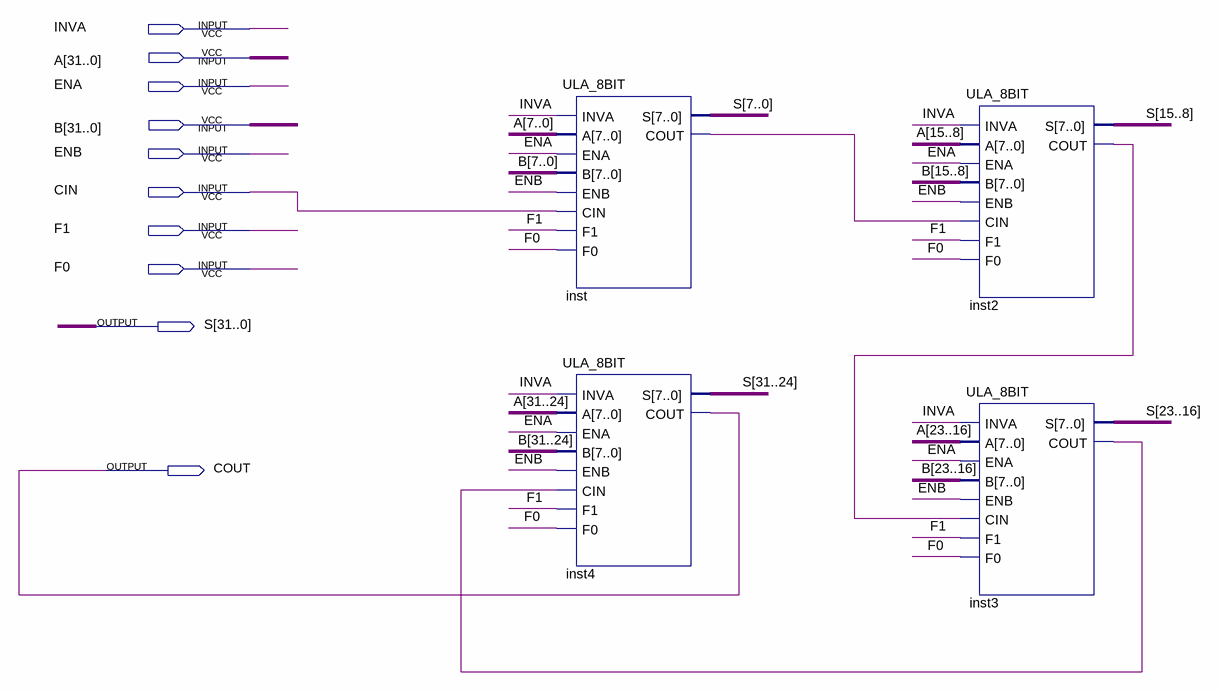
[diagram p0: schematic sheet]
// Quartus schematic ULA_32BIT.bdf as structural Verilog: 4 symbols, 10 pins
module ULA_32BIT (
  input  INVA,
  input  [31:0] A,
  input  ENA,
  input  [31:0] B,
  input  ENB,
  input  CIN,
  input  F1,
  input  F0,
  output [31:0] S,
  output COUT
);

  wire inst2_cout, inst3_cout, inst_cout;

  ULA_8BIT inst (
    .INVA(INVA), .A(A[7:0]), .ENA(ENA), .B(B[7:0]), .ENB(ENB), .CIN(CIN), .F1(F1), .F0(F0), .S(S[7:0]),
    .COUT(inst_cout));
  ULA_8BIT inst4 (
    .INVA(INVA), .A(A[31:24]), .ENA(ENA), .B(B[31:24]), .ENB(ENB), .CIN(inst3_cout), .F1(F1), .F0(F0),
    .S(S[31:24]), .COUT(COUT));
  ULA_8BIT inst2 (
    .INVA(INVA), .A(A[15:8]), .ENA(ENA), .B(B[15:8]), .ENB(ENB), .CIN(inst_cout), .F1(F1), .F0(F0),
    .S(S[15:8]), .COUT(inst2_cout));
  ULA_8BIT inst3 (
    .INVA(INVA), .A(A[23:16]), .ENA(ENA), .B(B[23:16]), .ENB(ENB), .CIN(inst2_cout), .F1(F1), .F0(F0),
    .S(S[23:16]), .COUT(inst3_cout));
endmodule
